# EAGLE board TCU_UCU_PCB_Rev2 (EAGLE 9.6.2)
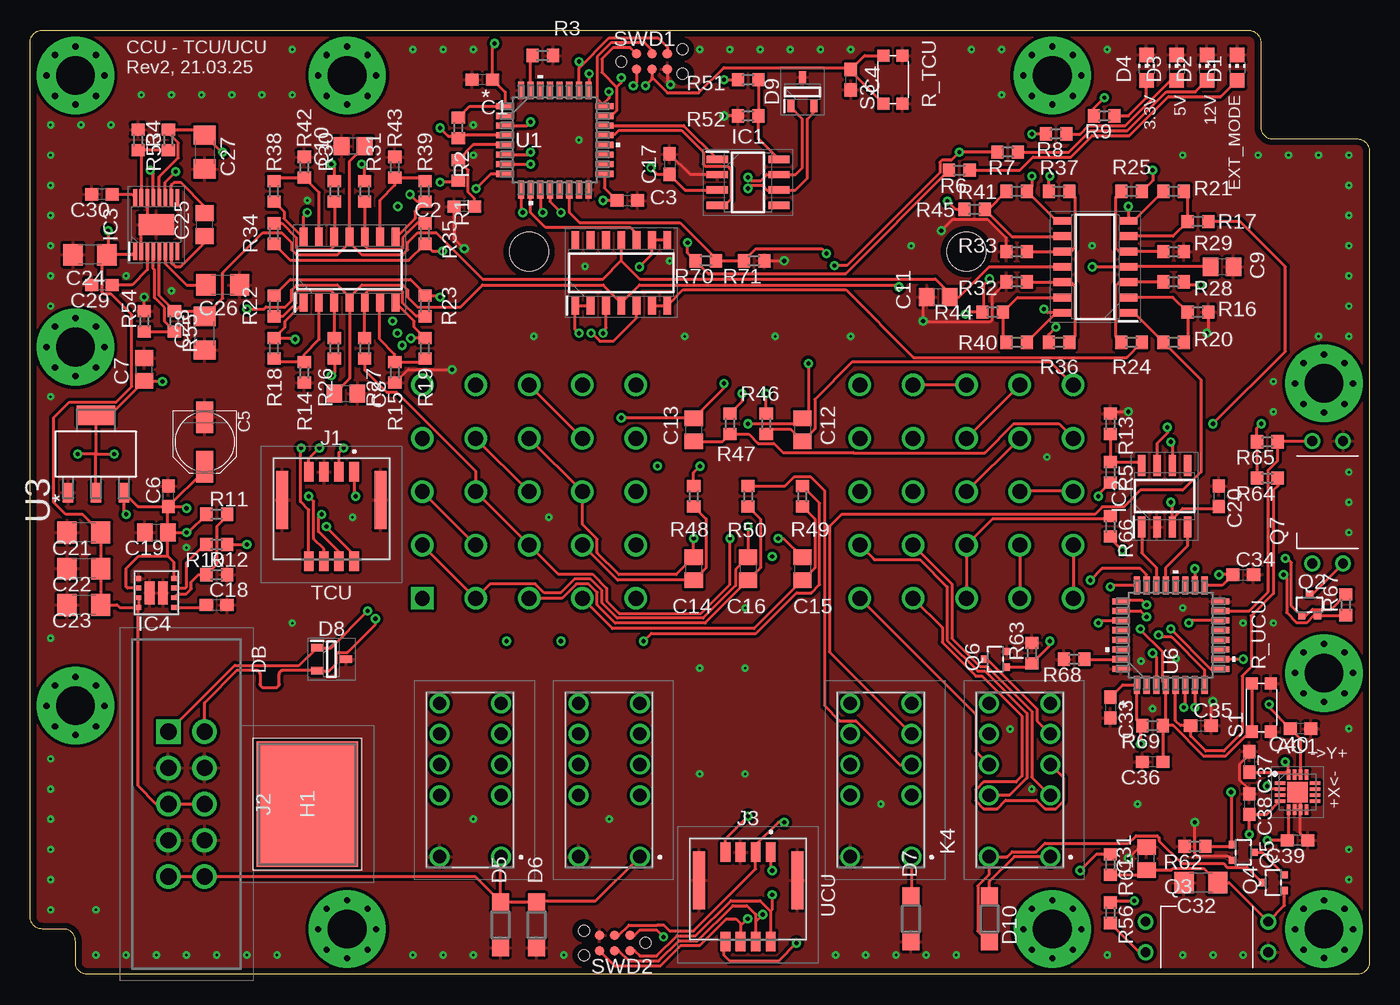
[diagram p7: board, top side]
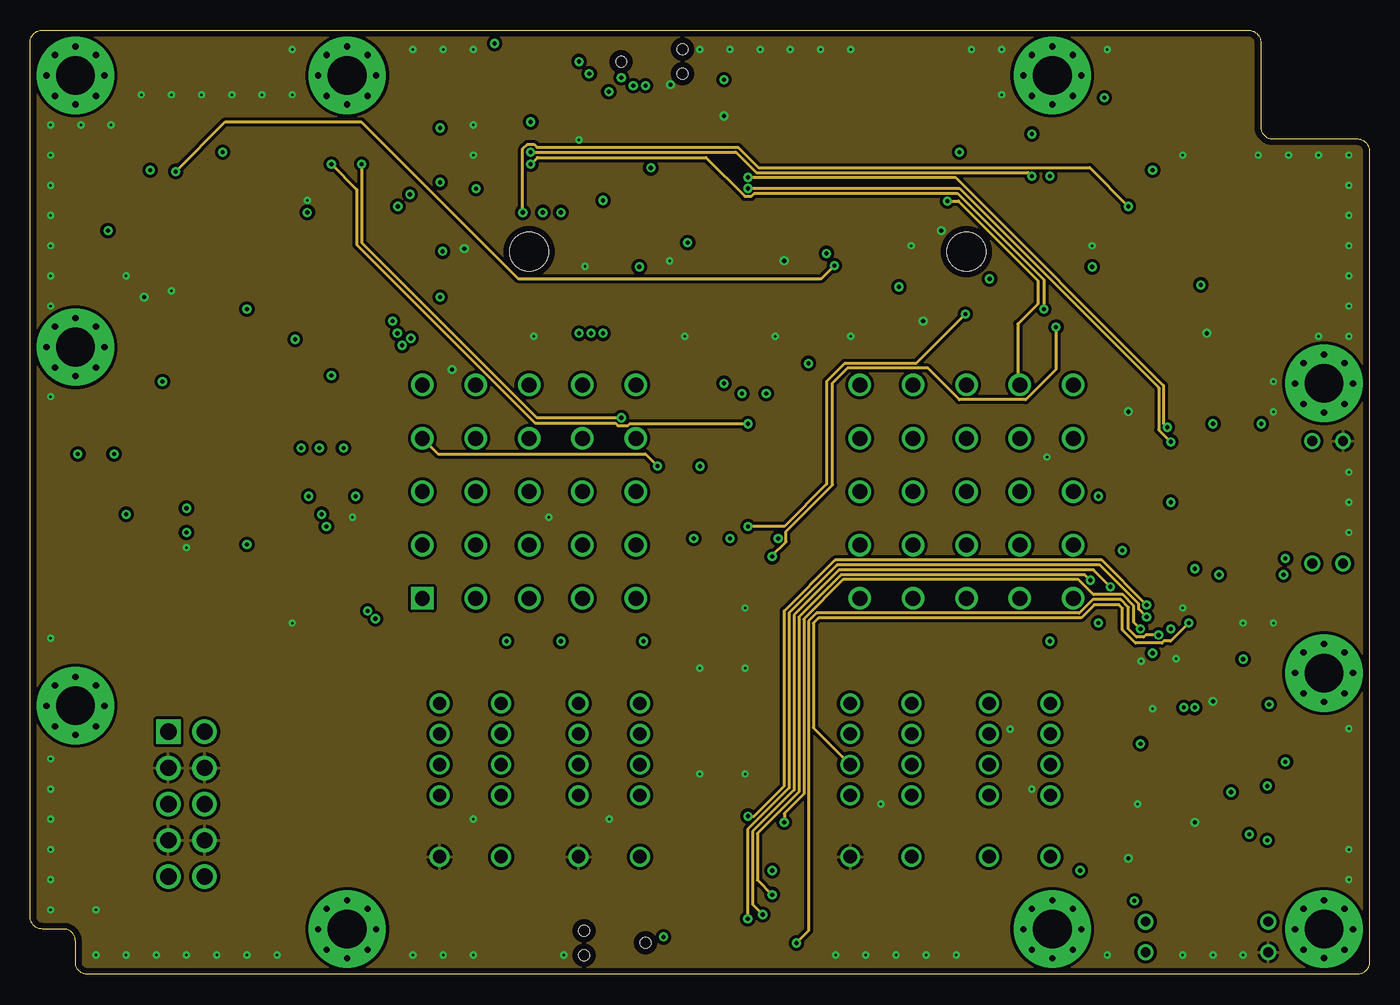
[diagram p8: board, inner layer Route2]
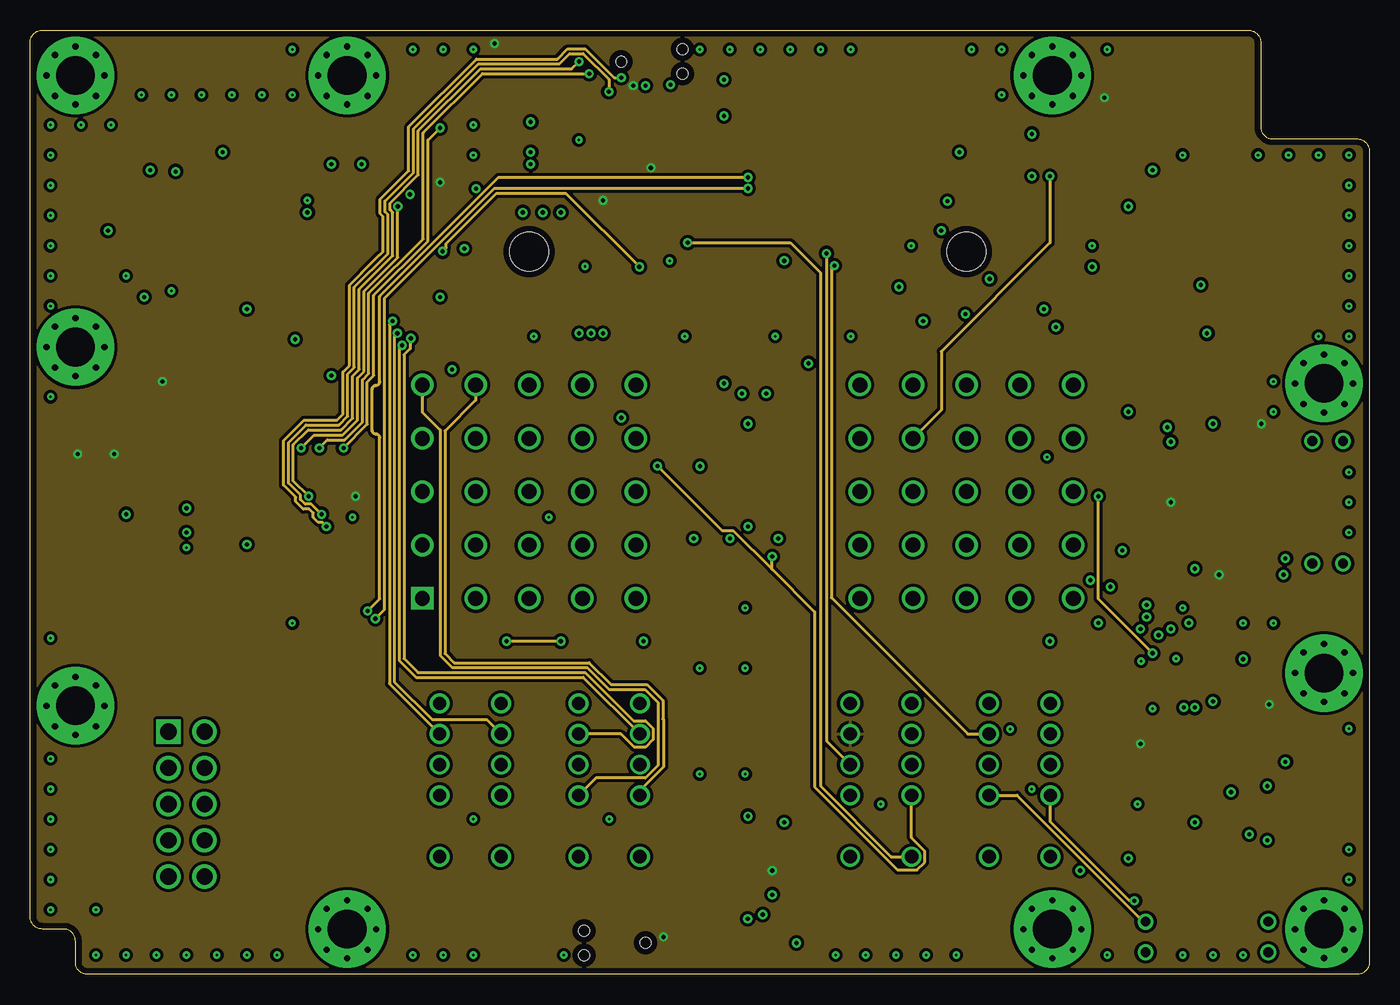
[diagram p9: board, inner layer Route15]
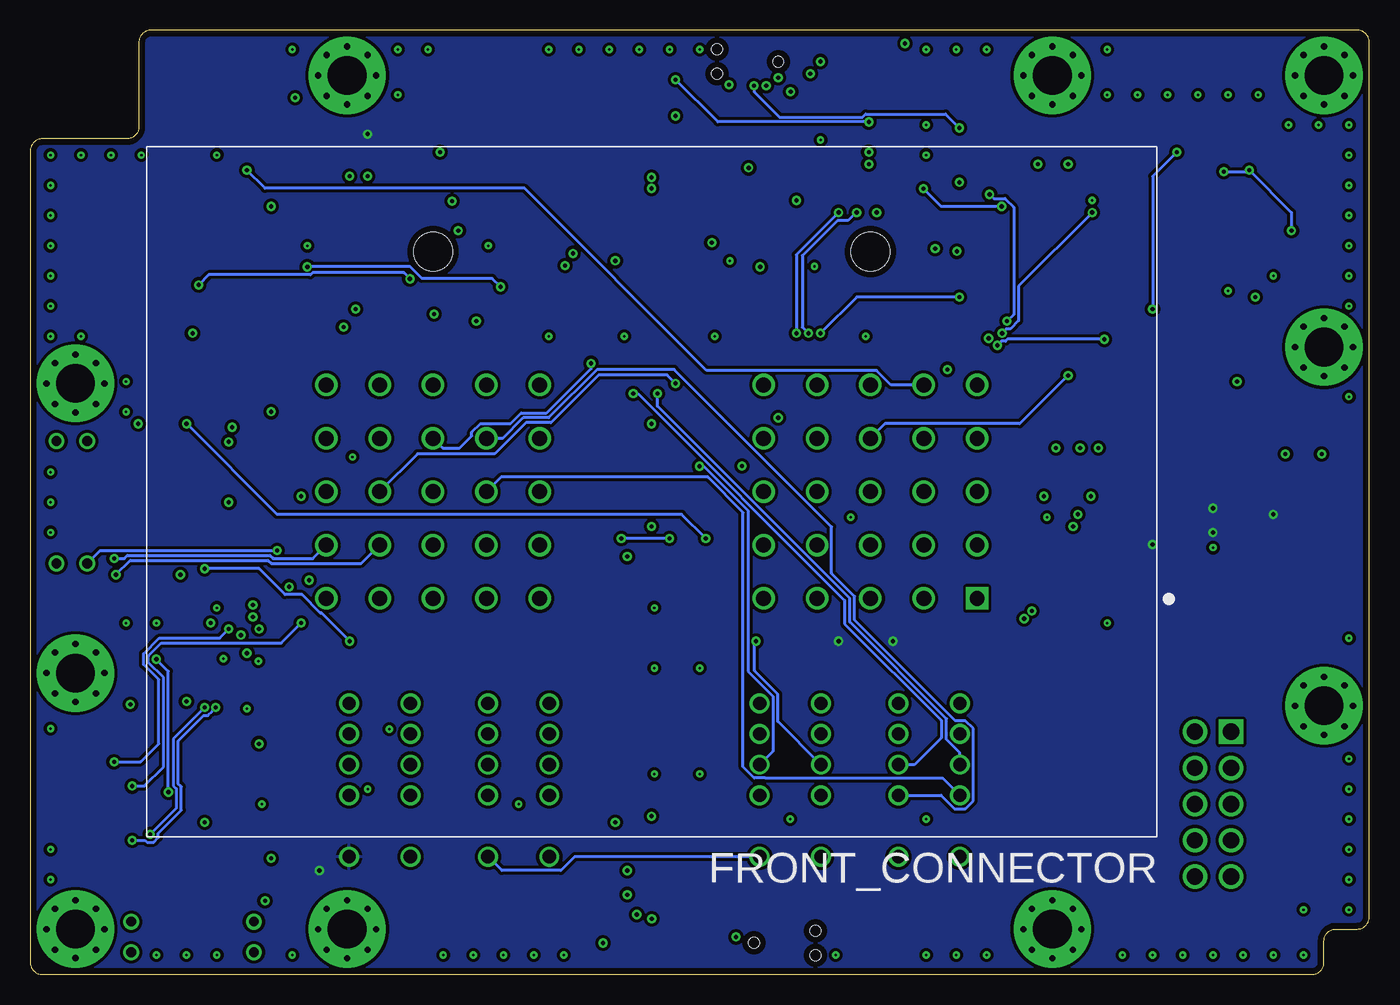
[diagram p10: board, bottom side, seen from below]

Size 110.89 x 78.2 mm. Coordinates in mm from the lower left corner, seen from the top.
Outline: 1,78.2 100.89,78.2 arc-90 101.89,77.2 101.89,70.2 arc90 102.89,69.2 109.89,69.2 arc-90 110.89,68.2 110.89,1 arc-90 109.89,0 4.75,0 arc-90 3.75,1 3.75,2.75 arc90 2.75,3.75 1,3.75 arc-90 0,4.75 0,77.2 arc-90 1,78.2
Copper layers (1+2*15+16): Top 0.043mm / dielectric 0.1248mm / Route2 0.035mm / dielectric 1.2mm / Route15 0.035mm / dielectric 0.1248mm / Bottom 0.043mm
Design rules "default *": minimum track width 6mil, minimum drill 0.2mm, track to track 6mil, track to pad 6mil, pad to pad 6mil, via to via 6mil, smd to smd 6mil, copper to edge 20mil, drill to drill 6mil, minimum pad ring 10mil, minimum via ring 8mil, stop-mask expansion 4mil, vias tented up to drill 0mil, thermal gap 10mil
Net classes: 0 default: width 0.2 mm; 1 12VPower: width 3.81 mm

## Footprints (pad centres in the part's own frame; a part is rotated, then mirrored left to right if it is on the bottom)
QFN50P300X300X150-17N = smd 0.85 x 0.3: 1 -1.45,0.75; 2 -1.45,0.25; 3 -1.45,-0.25; 4 -1.45,-0.75; 9 1.45,-0.75; 10 1.45,-0.25; 11 1.45,0.25; 12 1.45,0.75 | smd 0.3 x 0.85: 5 -0.75,-1.45; 6 -0.25,-1.45; 7 0.25,-1.45; 8 0.75,-1.45; 13 0.75,1.45; 14 0.25,1.45; 15 -0.25,1.45; 16 -0.75,1.45 | smd 1.7 x 1.7: 17 0,0
C0603 = smd 1.1 x 1: 1 -0.85,0; 2 0.85,0
PANASONIC_C = smd 2.6 x 1.4: + 2.05,0; - -2.05,0
C0805 = smd 1.3 x 1.5: 1 -0.95,0; 2 0.95,0
C1206 = smd 1.6 x 1.8: 1 -1.4,0; 2 1.4,0
CHIP-LED0805 = smd 1.2 x 1.2: A 0,-1.05; C 0,1.05
SOD123 = smd 1.4 x 1.4: A 1.9,0; C -1.9,0
SOT96P237X111-3N = smd 1 x 0.6: 1 -1.2,0.955; 2 -1.2,-0.955; 3 1.2,0
TE_DRC22-50P01 = drill 1.24 square: 1 -26.95,8.84 | drill 1.24: 2 -22.53,8.84; 3 -18.11,8.84; 4 -13.69,8.84; 5 -9.27,8.84; 6 9.27,8.84; 7 13.69,8.84; 8 18.11,8.84; 9 22.53,8.84; 10 26.95,8.84; 11 -26.95,4.42; 12 -22.53,4.42; 13 -18.11,4.42; 14 -13.69,4.42; 15 -9.27,4.42; 16 9.27,4.42; 17 13.69,4.42; 18 18.11,4.42; 19 22.53,4.42; 20 26.95,4.42; 21 -26.95,0; 22 -22.53,0; 23 -18.11,0; 24 -13.69,0; 25 -9.27,0; 26 9.27,0; 27 13.69,0; 28 18.11,0; 29 22.53,0; 30 26.95,0; 31 -26.95,-4.42; 32 -22.53,-4.42; 33 -18.11,-4.42; 34 -13.69,-4.42; 35 -9.27,-4.42; 36 9.27,-4.42; 37 13.69,-4.42; 38 18.11,-4.42; 39 22.53,-4.42; 40 26.95,-4.42; 41 -26.95,-8.84; 42 -22.53,-8.84; 43 -18.11,-8.84; 44 -13.69,-8.84; 45 -9.27,-8.84; 46 9.27,-8.84; 47 13.69,-8.84; 48 18.11,-8.84; 49 22.53,-8.84; 50 26.95,-8.84 | hole 3.2: 18.11,-19.89; -18.11,-19.89
S813146R = smd 10.4 x 8.4: 1 0,0
SOT127P600X175-8N = smd 1.75 x 0.6: 1 -2.55,1.905; 2 -2.55,0.635; 3 -2.55,-0.635; 4 -2.55,-1.905; 5 2.55,-1.905; 6 2.55,-0.635; 7 2.55,0.635; 8 2.55,1.905
SOP50P490X110-17N = smd 1.425 x 0.3: 1 -2.212,1.75; 2 -2.212,1.25; 3 -2.212,0.75; 4 -2.212,0.25; 5 -2.212,-0.25; 6 -2.212,-0.75; 7 -2.212,-1.25; 8 -2.212,-1.75; 9 2.212,-1.75; 10 2.212,-1.25; 11 2.212,-0.75; 12 2.212,-0.25; 13 2.212,0.25; 14 2.212,0.75; 15 2.212,1.25; 16 2.212,1.75 | smd 1.753 x 2.947: 17 0,0
SIL0008E = smd 0.45 x 0.4: 1 -1.475,1.2; 2 -1.475,0.4; 3 -1.475,-0.4; 4 -1.475,-1.2; 5 1.475,-1.2; 6 1.475,-0.4; 7 1.475,0.4; 8 1.475,1.2 | smd 0.8 x 1.9: 9 0.55,0; 10 -0.55,0
5054330871 = smd 0.8 x 1.6: 1 1.875,3.517; 2 1.875,-3.873; 3 0.625,3.517; 4 0.625,-3.873; 5 -0.625,3.517; 6 -0.625,-3.873; 7 -1.875,3.517; 8 -1.875,-3.873 | smd 1 x 4.8: MP1 4.075,1.177; MP2 -4.075,1.177
M300MV31045M1 = drill 1.35 pad 2.025 square: 1 0,0 | drill 1.35 pad 2.025: 2 3,0; 3 6,0; 4 9,0; 5 12,0; 6 0,3; 7 3,3; 8 6,3; 9 9,3; 10 12,3
413937885 = drill 1.1 pad 1.65: 1 -6.35,-2.54; 3 -1.27,-2.54; 4 1.27,-2.54; 5 3.81,-2.54; 6 6.35,-2.54; 7 6.35,2.54; 8 3.81,2.54; 9 1.27,2.54; 10 -1.27,2.54; 12 -6.35,2.54
SOT323 = smd 0.6 x 0.55: 1 -0.65,-0.925; 2 0.65,-0.925; 3 0,0.925
DIL04-400 = drill 0.813 pad 1.3: 1 -1.27,-5.08; 2 1.27,-5.08; 3 1.27,5.08; 4 -1.27,5.08
R0603 = smd 1 x 1.1: 1 -0.85,0; 2 0.85,0
KMR621NGLFS = smd 1 x 1: 1 -2,-0.8; 2 2,-0.8; 3 -2,0.8; 4 2,0.8
TC2030-IDC-NL = smd 0.787 x 0.787: 1 1.27,-0.635; 2 1.27,0.635; 3 2.54,-0.635; 4 2.54,0.635; 5 3.81,-0.635; 6 3.81,0.635 | hole 0.889: 0,0; 5.08,-1.016; 5.08,1.016
LQFP-32 = smd 1.473 x 0.508: 1 -4.115,2.8; 2 -4.115,2; 3 -4.115,1.2; 4 -4.115,0.4; 5 -4.115,-0.4; 6 -4.115,-1.2; 7 -4.115,-2; 8 -4.115,-2.8; 17 4.115,-2.8; 18 4.115,-2; 19 4.115,-1.2; 20 4.115,-0.4; 21 4.115,0.4; 22 4.115,1.2; 23 4.115,2; 24 4.115,2.8 | smd 0.508 x 1.473: 9 -2.8,-4.115; 10 -2,-4.115; 11 -1.2,-4.115; 12 -0.4,-4.115; 13 0.4,-4.115; 14 1.2,-4.115; 15 2,-4.115; 16 2.8,-4.115; 25 2.8,4.115; 26 2,4.115; 27 1.2,4.115; 28 0.4,4.115; 29 -0.4,4.115; 30 -1.2,4.115; 31 -2,4.115; 32 -2.8,4.115
SOIC127P600X175-14N = smd 1.525 x 0.65: 1 -2.712,3.81; 2 -2.712,2.54; 3 -2.712,1.27; 4 -2.712,0; 5 -2.712,-1.27; 6 -2.712,-2.54; 7 -2.712,-3.81; 8 2.712,-3.81; 9 2.712,-2.54; 10 2.712,-1.27; 11 2.712,0; 12 2.712,1.27; 13 2.712,2.54; 14 2.712,3.81
SOT230P700X180-4N = smd 1.626 x 0.889: 1 -3.2,2.311; 2 -3.2,0; 3 -3.2,-2.311 | smd 1.626 x 3.175: 4 3.2,0
M3_MOUNTING_HOLE = drill 0.5 pad 0.8: P$1 -2.4,0; P$2 0,2.4; P$3 2.4,0; P$4 0,-2.4; P$5 -1.697,1.697; P$6 1.697,1.697; P$7 1.697,-1.697; P$8 -1.697,-1.697 | drill 3.2 pad 6.4: P$10 0,0

## Placement (x,y rotation side)
AC1  ADXL377BCPZ-RL7  [QFN50P300X300X150-17N]  104.95,15.1 0 top
C1  0.1uF  [C0603]  37.45,74.1 180 top
C2  0.1uF  [C0603]  35.95,63.6 180 top
C3  0.1uF  [C0603]  49.45,64.1 0 top
C4  0.1uF  [C0603]  67.95,74.1 270 top
C5  100uF  [PANASONIC_C]  14.45,44.1 270 top
C6  100nF  [C0603]  11.45,39.6 90 top
C7  10uF  [C0805]  9.45,50.1 90 top
C8  0.1uF  [C0805]  26.15,48.1 0 top
C9  0.1uF  [C0805]  98.7,58.6 0 top
C10  0.1uF  [C0805]  26.75,68.6 180 top
C11  0.1uF  [C0805]  75.2,56.1 180 top
C12  10 uF  [C0805]  63.95,45.1 270 top
C13  10 uF  [C0805]  54.95,45.1 270 top
C14  10 uF  [C0805]  54.95,33.6 270 top
C15  10 uF  [C0805]  63.95,33.6 270 top
C16  10 uF  [C0805]  59.45,33.6 270 top
C17  0.1uF  [C0603]  52.95,67.1 270 top
C18  3.3nF  [C0603]  15.45,30.6 0 top
C19  22uF  [C0805]  10.45,36.6 180 top
C20  0.1uF  [C0603]  98.45,39.6 270 top
C21  10uF  [C1206]  4.45,36.6 180 top
C22  10uF  [C1206]  4.45,33.6 180 top
C23  10uF  [C1206]  4.45,30.6 180 top
C24  10uF  [C1206]  4.95,59.6 180 top
C25  1uF  [C0805]  14.45,62.1 90 top
C26  10uF  [C1206]  15.95,57.1 180 top
C27  10uF  [C1206]  14.45,68.1 270 top
C28  10uF  [C1206]  14.45,53.1 90 top
C29  10nF  [C0603]  5.95,57.1 180 top
C30  10nF  [C0603]  5.95,64.6 180 top
C31  10 uF  [C0805]  92.45,9.6 90 top
C32  -  [C1206]  96.95,7.6 180 top
C33  0.1uF  [C0603]  89.45,22.1 270 top
C34  0.1uF  [C0603]  100.45,33.1 0 top
C35  0.1uF  [C0603]  96.95,20.6 0 top
C36  0.1uF  [C0603]  92.95,17.6 180 top
C37  50nF  [C0603]  100.95,17.6 270 top
C38  50nF  [C0603]  100.95,14.1 270 top
C39  50nF  [C0603]  104.95,11.1 180 top
C40  0.1uF  [C0603]  105.2,20.35 180 top
D1  12V_AUTO-POW  [CHIP-LED0805]  99.95,75.1 0 top
D2  12V-POW  [CHIP-LED0805]  97.45,75.1 0 top
D3  5V-POW  [CHIP-LED0805]  94.95,75.1 0 top
D4  3.3V-POW  [CHIP-LED0805]  92.45,75.1 0 top
D5  PMEG4010  [SOD123]  38.95,4.1 270 top
D6  PMEG4010  [SOD123]  41.95,4.1 270 top
D7  PMEG4010  [SOD123]  72.95,4.6 270 top
D8  SZNUP2105LT1G  [SOT96P237X111-3N]  24.95,26.1 0 top
D9  SZNUP2105LT1G  [SOT96P237X111-3N]  63.95,73.1 90 top
D10  PMEG4010  [SOD123]  79.45,4.6 270 top
FRONT_CONNECTOR  DRC22-50P01  [TE_DRC22-50P01]  59.42,39.97 180 bottom
H1  S8131-46R  [S813146R]  22.95,14.1 90 top
IC1  SN65HVD230DR  [SOT127P600X175-8N]  59.45,65.6 0 top
IC2  SN65HVD230DR  [SOT127P600X175-8N]  93.95,39.6 90 top
IC3  LTC3260EMSE#PBF  [SOP50P490X110-17N]  10.45,62.1 90 top
IC4  LMZ21700SILT  [SIL0008E]  10.45,31.6 180 top
J1  505433-0871  [5054330871]  24.95,38.1 0 top
J2  M300-MV31045M1  [M300MV31045M1]  11.45,20.1 270 top
J3  505433-0871  [5054330871]  59.45,6.6 0 top
K1  V23079A1003B301  [413937885]  36.45,16.1 90 top
K2  V23079A1003B301  [413937885]  47.95,16.1 90 top
K3  V23079A1003B301  [413937885]  70.45,16.1 90 top
K4  V23079A1001B301  [413937885]  81.95,16.1 90 top
Q2  2N7002PW,115  [SOT323]  105.95,30.6 0 top
Q3  VO618A-3  [DIL04-400]  97.45,3.1 270 top
Q4  2N7002PW,115  [SOT323]  102.95,7.6 90 top
Q5  2N7002PW,115  [SOT323]  100.45,10.1 270 top
Q6  2N7002PW,115  [SOT323]  79.95,26.1 90 top
Q7  VO618A-3  [DIL04-400]  107.45,39.1 0 top
R1  BLM18PG471SN1D  [R0603]  35.45,66.6 270 top
R2  10K  [R0603]  35.45,70.1 90 top
R3  10K  [R0603]  42.45,76.1 0 top
R4  1.3M  [R0603]  11.45,69.1 90 top
R5  -  [R0603]  89.45,41.6 270 top
R6  4K3  [R0603]  76.95,66.6 180 top
R7  4K3  [R0603]  80.95,68.1 180 top
R8  1K6  [R0603]  84.95,69.6 180 top
R9  1K1  [R0603]  88.95,71.1 180 top
R10  10K 1%  [R0603]  15.45,35.6 180 top
R11  232K 1%  [R0603]  15.45,38.1 0 top
R12  44K2 1%  [R0603]  15.45,33.1 0 top
R13  0R  [R0603]  89.45,45.6 270 top
R14  4k7  [R0603]  22.7,49.85 270 top
R15  4k7  [R0603]  30.2,49.85 270 top
R16  4k7  [R0603]  96.7,54.85 0 top
R17  6k8  [R0603]  96.7,62.35 0 top
R18  6k8  [R0603]  20.2,51.85 270 top
R19  6k8  [R0603]  32.7,51.85 270 top
R20  6k8  [R0603]  94.7,52.35 0 top
R21  3k9  [R0603]  94.7,64.85 0 top
R22  4k7  [R0603]  20.2,55.35 90 top
R23  4k7  [R0603]  32.7,55.35 90 top
R24  4k7  [R0603]  91.2,52.35 0 top
R25  6k8  [R0603]  91.2,64.85 0 top
R26  6k8  [R0603]  25.2,51.85 90 top
R27  6k8  [R0603]  27.7,51.85 90 top
R28  6k8  [R0603]  94.7,57.35 180 top
R29  3k9  [R0603]  94.7,59.85 180 top
R30  6k8  [R0603]  25.2,64.85 270 top
R31  6k8  [R0603]  27.7,64.85 270 top
R32  3k9  [R0603]  81.7,57.35 0 top
R33  3k9  [R0603]  81.7,59.85 0 top
R34  4k7  [R0603]  20.2,61.35 270 top
R35  4k7  [R0603]  32.7,61.35 270 top
R36  6k8  [R0603]  85.2,52.35 180 top
R37  6k8  [R0603]  85.2,64.85 180 top
R38  6k8  [R0603]  20.2,64.85 90 top
R39  6k8  [R0603]  32.7,64.85 90 top
R40  3k9  [R0603]  81.7,52.35 180 top
R41  3k9  [R0603]  81.7,64.85 180 top
R42  4k7  [R0603]  22.7,66.85 90 top
R43  4k7  [R0603]  30.2,66.85 90 top
R44  6k8  [R0603]  79.7,54.85 180 top
R45  6k8  [R0603]  78.2,63.35 180 top
R46  200R  [R0603]  60.95,45.6 90 top
R47  200R  [R0603]  57.95,45.6 270 top
R48  200R  [R0603]  54.95,39.6 90 top
R49  200R  [R0603]  63.95,39.6 90 top
R50  200R  [R0603]  59.45,39.6 90 top
R51  -  [R0603]  59.45,74.1 180 top
R52  0R  [R0603]  59.45,71.1 0 top
R53  200K  [R0603]  8.95,69.1 270 top
R54  200K  [R0603]  9.45,54.1 90 top
R55  1.3M  [R0603]  11.95,54.1 270 top
R56  10K  [R0603]  89.45,5.1 270 top
R61  100K  [R0603]  89.45,9.1 270 top
R62  10K  [R0603]  96.45,10.6 180 top
R63  10K  [R0603]  82.95,26.6 90 top
R64  BLM18PG471SN1D  [R0603]  102.45,41.1 180 top
R65  10K  [R0603]  102.45,44.1 180 top
R66  113K  [R0603]  89.45,37.1 270 top
R67  100K  [R0603]  108.95,30.6 90 top
R68  10K  [R0603]  86.45,26.1 180 top
R69  10K  [R0603]  92.95,20.6 180 top
R70  15K  [R0603]  55.95,59.1 180 top
R71  3K9  [R0603]  59.95,59.1 180 top
S1  KMR621NGLFS  [KMR621NGLFS]  101.95,22.1 90 top
S3  KMR621NGLFS  [KMR621NGLFS]  71.45,74.1 90 top
SWD1  SWD_TAGCONNECTNO-LEG  [TC2030-IDC-NL]  48.95,75.6 0 top
SWD2  SWD_TAGCONNECTNO-LEG  [TC2030-IDC-NL]  50.95,2.6 180 top
U1  STM32F303K8  [LQFP-32]  43.45,69.1 0 top
U2  TL074ID  [SOIC127P600X175-14N]  48.95,58.1 90 top
U3  LD1117S33TR  [SOT230P700X180-4N]  5.45,43.1 90 top
U4  TL074ID  [SOIC127P600X175-14N]  26.45,58.35 90 top
U5  TL074ID  [SOIC127P600X175-14N]  88.2,58.6 180 top
U6  STM32F303K8  [LQFP-32]  94.45,28.1 90 top
U$1  M3_MOUNTING_HOLE  [M3_MOUNTING_HOLE]  26.25,3.75 90 top
U$2  M3_MOUNTING_HOLE  [M3_MOUNTING_HOLE]  84.64,3.75 90 top
U$3  M3_MOUNTING_HOLE  [M3_MOUNTING_HOLE]  107.14,3.75 90 top
U$4  M3_MOUNTING_HOLE  [M3_MOUNTING_HOLE]  107.14,24.95 90 top
U$5  M3_MOUNTING_HOLE  [M3_MOUNTING_HOLE]  107.14,48.95 90 top
U$6  M3_MOUNTING_HOLE  [M3_MOUNTING_HOLE]  84.64,74.45 90 top
U$7  M3_MOUNTING_HOLE  [M3_MOUNTING_HOLE]  26.25,74.45 90 top
U$8  M3_MOUNTING_HOLE  [M3_MOUNTING_HOLE]  3.75,74.45 90 top
U$9  M3_MOUNTING_HOLE  [M3_MOUNTING_HOLE]  3.75,51.95 90 top
U$10  M3_MOUNTING_HOLE  [M3_MOUNTING_HOLE]  3.75,22.25 90 top

## Tracks (layer width: path | path; a pad name or v marks a point on that pad's centre or on a via)
12V  (via drill 0.35)
  Top 0.25: C24.1 8.41,59.6 IC3.1 | IC4.8 7.4,30.4 7.2,30.6 C23.1 C22.1 C21.1 4.35,38.1 2.95,38.1 1.95,39.1 1.95,46.1 3.24,47.39 7.12,47.39 8.42,48.69 8.42,54.63 6.72,56.32 6.13,56.32 5.97,56.48 5.97,57.08 5.95,57.1 5.95,59.2 C24.1 | IC4.7 IC4.8 | IC4.8 8.95,30.37 8.95,15.6 10.45,14.1 J2.3 J2.8 | IC3.13 10.2,66.35 v9.95,66.6 | v6.45,61.6 6.45,59.7 C24.1 | IC3.11 11.2,65.63 v12.06,66.49 | R7.2 v76.95,68.1 76.27,67.43 75.48,67.43 75.32,67.26 75.32,66.39 67.63,58.7 v66.6,58.7
  Route2 0.25: v12.06,66.49 16.17,70.6 27.42,70.6 40.39,57.63 65.53,57.63 v66.6,58.7
  Route15 0.25: v66.6,58.7 66.35,58.45 66.35,31.2 77.64,19.91 K4.8
  Bottom 0.25: v6.45,61.6 6.45,63.1 v9.95,66.6 10.06,66.49 v12.06,66.49
+3V3  (via drill 0.35)
  Top 0.25: U3.2 5.45,43.1 | 5.45,43.1 U3.4 6.6,46.3 C7.1 10.9,49.15 v10.95,49.1 | 5.45,43.1 v3.95,43.1 | 5.45,43.1 v6.95,43.1 | J1.1 26.82,39.72 v26.95,39.6 | v38.45,77.1 38.3,76.95 C1.1 39.33,73.06 U1.1 36.4,71.9 R2.2 | R1.2 35.3,65.6 v33.95,65.6 | U1.17 47.56,65.13 C3.1 v47.45,64.1 | IC1.3 54.23,64.96 C17.2 51.95,66.25 v51.4,66.8 | R9.2 88.1,71.75 v88.95,72.6 | U6.17 98.71,32.21 C34.1 v98.45,33.1 | C20.2 98.45,38.6 95.45,38.6 94.58,37.73 IC2.3 94.58,38.96 v94.45,39.1 | R64.2 R65.2 101.6,45.25 v101.95,45.6 | v91.95,19.1 91.95,20.45 R69.2 91.65,21.05 U6.1 90.48,23.98 C33.1 | J3.1 61.32,8.72 v61.45,8.6 | SWD1.1 50.22,73.87 v49.95,73.6 | SWD2.1 50.06,3.23 50.5,3.68 51.87,3.68 v52.45,3.1 | AC1.15 AC1.14 105.2,19.5 C40.2 102.6,22.1 v102.6,22.35
  pour Route15 (isolate 0.254): -0.05,78.6 110.95,78.6 110.95,0.1 -0.05,0.1
+5V  (via drill 0.35)
  Top 0.25: K4.1 81.49,9.75 79.45,7.71 D10.C | IC4.4 11.92,34.12 11.4,34.65 | 11.4,34.65 C19.1 | C19.1 11.4,38.7 C6.1 | IC4.6 8.05,32 7.95,32.1 7.95,33.6 9,34.65 11.4,34.65 | C19.1 v12.95,36.6 13.1,36.6 R11.1 | R10.1 v17.95,35.6 | C6.1 8.91,38.75 U3.3 7.76,38.29 v7.95,38.1 | C6.1 14.45,41.75 C5.+ | C6.1 12.8,38.75 v12.95,38.6 | R8.2 v82.95,69.6 | R61.1 88.3,9.95 v86.95,8.6
  Route15 0.25: v39.45,27.6 v43.95,27.6
  pour Bottom (isolate 0.254): -0.05,80.1 -0.05,0.1 110.95,0.1 110.95,79.6 110.95,80.1
+9V  (via drill 0.35)
  Top 0.25: IC3.12 10.7,66.06 12.27,67.63 12.27,68.86 11.45,69.69 R4.2 14,69.95 C27.1 15.85,68.1 v15.95,68.1 | C8.1 26.45,49.35 U4.4 26.45,56.1 | v17.95,55.1 19.35,55.1 19.53,55.28 21.12,55.28 21.63,55.78 21.63,56.68 22.05,57.1 25.45,57.1 26.45,56.1 | 26.45,56.1 27.45,57.1 30.84,57.1 31.26,56.68 31.26,56.1 32.08,55.28 35.62,55.28 37.45,57.1 47.45,57.1 48.95,55.6 | C9.1 U5.4 v87.95,58.6 | U2.4 48.95,55.6 | 48.95,55.6 50.45,57.1 71.79,57.1 v71.95,56.94
  Bottom 0.25: v15.95,68.1 17.95,66.1 v17.95,55.1 | v87.95,58.6 79.43,58.6 78.46,57.63 72.64,57.63 v71.95,56.94
+12V  (via drill 0.35)
  Top 0.25: D5.C 36.85,8.1 J2.10 J2.5 | D5.C D6.C 42.05,6.1 46.84,6.1 K2.1 | D5.C 38.95,9.71 K1.1 | K3.1 72.99,6.54 D7.C | R6.2 67.55,58.05 56.15,58.05 R70.2 54.45,59.75 v54.45,60.6
  Route15 0.25: v54.45,60.6 62.95,60.6 65.45,58.1 65.45,15.6 71.3,9.75 K3.1
  Bottom 0.25: K2.1 65.8,9.75 66.95,8.6 71.84,8.6 K3.1
-9V
  Top 0.25: IC3.5 10.7,56.2 R55.1 14,54.95 C28.2 15.95,56 15.95,58.1 19.27,61.42 20.81,61.42 21.63,60.6 21.63,60.02 22.05,59.6 25.45,59.6 26.45,60.6 | C10.1 26.45,67.35 U4.11 26.45,60.6 | 26.45,60.6 27.45,59.6 30.84,59.6 31.26,60.02 31.26,60.6 32.08,61.42 33.62,61.42 37.45,57.6 47.45,57.6 48.95,59.1 | C11.1 76.45,56.1 | 76.45,56.1 76.93,56.1 79.43,58.6 U5.11 | U2.11 48.95,59.1 | 48.95,59.1 50.45,57.6 74.95,57.6 76.45,56.1
ACC_ST  (via drill 0.35)
  Top 0.25: AC1.2 102.7,15.35 v102.45,15.6 | v88.45,29.1 88.65,29.3 U6.27
  Bottom 0.25: v102.45,15.6 101.45,15.6 99.85,17.2 99.85,24.57 101.1,25.83 101.1,26.37 100.03,27.44 90.1,27.44 v88.45,29.1
ACC_X  (via drill 0.35)
  Top 0.25: AC1.5 104.2,11.2 C39.2 v102.45,11.1 | v95.54,22.1 95.65,22.21 U6.6
  Bottom 0.25: v102.45,11.1 101.37,11.1 101.22,10.94 100.67,10.94 100.29,11.33 100.29,11.69 98.39,13.59 98.39,15.54 98.45,15.59 98.45,15.6 98.64,15.79 98.64,19.33 96.53,21.44 96.17,21.44 95.79,21.83 95.79,21.85 v95.54,22.1
ACC_Y  (via drill 0.35)
  Top 0.25: AC1.4 102.4,13.25 C38.2 v100.95,11.6 | U6.7 v96.45,22.1
  Bottom 0.25: v96.45,22.1 99.04,19.5 99.04,15.62 98.79,15.37 98.79,13.75 v100.95,11.6
ACC_Z  (via drill 0.35)
  Top 0.25: C37.2 104,16.75 AC1.16 104.2,17.35 v103.95,17.6 | v94.45,28.6 97.75,25.3 U6.9
  Bottom 0.25: v103.95,17.6 101.75,17.6 100.25,19.1 100.25,24.41 101.5,25.66 101.5,26.54 100.2,27.85 95.2,27.85 v94.45,28.6
APS1_GND  (via drill 0.35)
  Top 0.25: FRONT_CONNECTOR.33 FRONT_CONNECTOR.24 45.73,37.26 46.94,36.05 46.94,34.92 48.76,33.1 53.5,33.1 C14.1 v54.95,36.1 | R26.1 25.2,49.85 v24.95,49.6 | v97.95,45.6 103.95,51.6 103.95,58.6 100.2,62.35 R17.2
  Bottom 0.25: v24.95,49.6 28.94,45.6 40.11,45.6 FRONT_CONNECTOR.33 | v54.95,36.1 56.95,38.1 90.45,38.1 v97.95,45.6
APS1_IN  (via drill 0.35)
  Top 0.25: v92.95,66.6 92.95,65.75 R25.2
  Route15 0.25: FRONT_CONNECTOR.42 36.89,47.55 34.35,45 34.35,26.57 35.11,25.81 46.3,25.81 48.1,24 51.06,24 52.39,22.67 52.39,21.15 52.45,21.1 52.45,17.2 50.49,15.24 K2.3
  Bottom 0.25: FRONT_CONNECTOR.42 39.61,48.81 40.81,50.02 54.87,50.02 69.95,65.1 91.45,65.1 v92.95,66.6
APS1_OUT
  Top 0.25: FRONT_CONNECTOR.14 48.64,32.65 C14.2 55.97,33.68 55.97,37.72 R48.1
APS1_SIG_OUT  (via drill 0.35)
  Top 0.25: U4.1 22.44,55.44 22.44,55.43 21.1,54.1 21.1,53.6 R18.1 21.85,52.7 v21.95,52.6
  Route15 0.25: v30.81,52.1 30.56,51.85 30.56,25.99 31.95,24.6 45.8,24.6 K2.5
  Bottom 0.25: v21.95,52.6 29.98,52.6 30.14,52.44 30.46,52.44 v30.81,52.1
APS1_VCC
  Top 0.25: FRONT_CONNECTOR.34 FRONT_CONNECTOR.43
APS2_GND  (via drill 0.35)
  Top 0.25: v57.95,36.1 57.95,32.29 55.56,29.9 48.78,29.9 47.75,30.94 47.75,31.97 46.57,33.15 43.72,33.15 FRONT_CONNECTOR.13 FRONT_CONNECTOR.22 36.89,41.68 30.36,48.22 29.53,48.22 27.7,50.06 R27.1 | v61.95,36.1 62.4,36.1 C15.1
  Bottom 0.25: v57.95,36.1 v61.95,36.1
APS2_IN
  Route15 0.25: FRONT_CONNECTOR.41 32.47,46.57 33.95,45.1 33.95,26.4 34.95,25.4 46.13,25.4 47.93,23.6 50.9,23.6 51.99,22.5 51.99,17.31 50.94,16.27 46.84,16.27 K2.10
APS2_OUT
  Top 0.25: FRONT_CONNECTOR.4 48.22,28.65 59.95,28.65 C15.2 64.97,33.68 64.97,37.72 R49.1
APS2_SIG_OUT  (via drill 0.35)
  Top 0.25: U4.7 30.46,55.44 30.46,55.43 31.79,54.1 31.79,53.6 R19.1 31.55,52.7 v31.52,52.67
  Route15 0.25: v31.52,52.67 31.46,52.62 31.46,51.83 30.96,51.32 30.96,26.16 32.11,25 45.96,25 49.95,21.01 50.94,21.01 51.59,20.37 51.59,19.45 50.94,18.81 50.03,18.81 48.93,19.91 K2.8
APS2_VCC
  Top 0.25: FRONT_CONNECTOR.23 FRONT_CONNECTOR.32
APS_STM_ANOUT  (via drill 0.35)
  Top 0.25: R22.2 21.55,57.55 31.5,57.55 32.7,56.35 R23.2 33.85,56.2 v33.95,56.1 | v45.45,53.1 45.14,53.41 U2.1 U2.2
  Bottom 0.25: v33.95,56.1 42.45,56.1 v45.45,53.1
APS_STM_IN  (via drill 0.35)
  Top 0.25: U5.7 90.95,62.41 | 90.95,62.41 91.41,62.41 R21.1 | U1.9 40.65,63.24 v40.79,63.1 | v90.95,63.6 90.95,62.41
  Route2 0.25: v40.79,63.1 40.79,68.37 41.17,68.75 41.72,68.75 41.97,68.5 58.61,68.5 60.3,66.81 87.73,66.81 v90.95,63.6
APSFC_GND  (via drill 0.35)
  Top 0.25: FRONT_CONNECTOR.11 FRONT_CONNECTOR.2 38.1,32.34 41.81,32.34 42.56,31.6 43.92,31.6 45.07,32.74 46.4,32.74 47.34,31.8 47.34,30.77 48.61,29.5 55.73,29.5 58.42,32.19 58.42,33.52 C16.1 v59.45,37.1 | v79.45,57.6 78.95,57.1 78.95,54.95 R44.2 77.62,54.85 v77.45,54.68 | v96.95,57.1 95.8,57.1 R28.1
  Route2 0.25: v77.45,54.68 73.37,50.6 67.45,50.6 65.95,49.1 65.95,40.6 62.45,37.1 v59.45,37.1
  Bottom 0.25: v79.45,57.6 79.95,58.1 87.52,58.1 87.67,57.94 96.1,57.94 v96.95,57.1
APSFC_IN  (via drill 0.35)
  Top 0.25: R36.2 84.35,53 v84.95,53.6
  Route2 0.25: FRONT_CONNECTOR.31 33.77,43.1 50.95,43.1 v51.95,42.1 | v61.45,34.6 61.45,34.67 62.6,35.83 62.6,36.69 66.45,40.53 66.45,48.98 67.66,50.2 74.35,50.2 76.95,47.6 82.45,47.6 84.95,50.1 v84.95,53.6
  Route15 0.25: v51.95,42.1 57.29,36.75 58.22,36.75 61.41,33.56 | 61.41,33.56 64.95,30.03 64.95,15.53 71.83,8.65 73.44,8.65 74.09,9.29 74.09,10.21 72.99,11.31 K3.3 | 61.41,33.56 61.41,34.56 v61.45,34.6
APSFC_OUT
  Top 0.25: FRONT_CONNECTOR.3 44.03,31.13 45.23,32.34 46.23,32.34 46.94,31.63 46.94,30.6 48.45,29.1 55.9,29.1 C16.2 60.47,33.68 60.47,37.72 R50.1
APSFC_SIG_OUT
  Top 0.25: U5.1 91.41,54.79 R20.1 96.95,49.25 96.95,41.6 95.45,40.1 91.95,40.1 90.57,38.73 88.78,38.73 88.16,38.1 67.18,38.1 66.18,37.1 66.18,26.71 K3.5
APSFC_STM_ANOUT
  Top 0.25: U2.6 U2.7 54.07,56.7 67.55,56.7 73.15,51.1 90.8,51.1 R24.2
APSFC_STM_IN  (via drill 0.35)
  Top 0.25: R40.1 84.99,54.79 | 84.99,54.79 85.45,54.79 U5.14 | U1.7 v41.45,67.1 | 84.99,54.79 84.26,54.79 v83.95,55.1
  Route2 0.25: v41.45,67.1 42,67.65 55.97,67.65 59.17,64.44 59.72,64.44 59.97,64.7 76.78,64.7 83.95,57.53 v83.95,55.1
APSFC_VCC
  Top 0.25: FRONT_CONNECTOR.12 FRONT_CONNECTOR.21
BUZ_ECM_12V
  Top 0.25: FRONT_CONNECTOR.16 69.9,34.35 73.68,34.35 75.92,32.1 75.92,27.66 78.46,25.12 79.06,25.12 82.54,21.63 82.54,16.27 81.11,14.83 K4.10
  Route15 0.25: K4.10 81.72,14.83 92.18,4.37 Q3.1
BUZ_ECM_GND  (via drill 0.35)
  Top 0.25: R56.1 89.6,6.1 v91.45,6.1 | FRONT_CONNECTOR.17 76.33,32.34 76.33,27.83 78.63,25.52 79.22,25.52 82.95,21.8 82.95,16.32 84.44,14.83 K4.3
  Route15 0.25: v91.45,6.1 91.02,6.1 84.49,12.63 K4.3
BUZ_STE_12V
  Top 0.25: K4.9 78.3,18.47 78.3,21.52 FRONT_CONNECTOR.6
BUZ_STE_GND
  Top 0.25: FRONT_CONNECTOR.7 75.52,28.73 75.52,27.49 78.3,24.72 78.83,24.72 82.14,21.4 82.14,16.43 81.64,15.93 78.95,15.93 78.3,15.29 78.3,14.37 78.95,13.73 80.07,13.73 80.77,14.43 83.33,14.43 84.03,13.73 84.94,13.73 85.59,14.37 85.59,16.27 K4.4
BUZZER_EN  (via drill 0.35)
  Top 0.25: R62.1 99.37,10.6 Q5.1 99.52,15.02 v99.45,15.1 | v100.45,26.1 U6.10
  Bottom 0.25: v99.45,15.1 99.45,25.1 v100.45,26.1
BUZZER_ON  (via drill 0.35)
  Top 0.25: Q6.1 82.65,25.45 R63.1 84.45,27.25 v84.45,27.6 | v96.45,33.6 U6.18
  Bottom 0.25: v84.45,27.6 86.78,29.93 86.87,29.93 88.39,31.44 89.79,31.44 91.95,33.6 v96.45,33.6
CAN_N  (via drill 0.35)
  Top 0.25: J2.6 14.45,22.5 17.14,25.19 18.71,25.19 arc-90 19.02,24.87 19.02,24.07 arc90 19.34,23.75 20.31,23.75 arc90 20.63,24.07 20.63,24.87 arc-90 20.95,25.19 23.7,25.19 D8.2 24.75,25.14 25.37,25.77 25.37,26.51 25.53,26.68 26.28,26.68 28.59,28.99 v28.59,29.46 | v59.45,65.1 59.7,65.35 60.61,65.35 61,64.96 IC1.6 63.37,64.96 64.35,65.94 64.35,70.85 64.9,71.4 D9.2 | v94.45,44.1 94.58,43.96 IC2.6
  Route2 0.25: v59.45,65.1 76.95,65.1 93.45,48.6 93.45,45.1 v94.45,44.1
  Route15 0.25: v28.59,29.46 29.35,30.22 29.35,56 38.45,65.1 v59.45,65.1
CAN_P  (via drill 0.35)
  Top 0.25: v27.95,30.1 24.9,27.05 D8.1 22.29,25.6 16.95,25.6 J2.1 | v59.45,66.01 59.7,65.75 60.52,65.75 61,66.23 IC1.7 63.37,66.23 63.95,66.81 63.95,70.84 62.99,71.8 D9.1 | v94.16,45.31 94.16,44.81 93.31,43.96 IC2.7
  Route2 0.25: v59.45,66.01 76.61,66.01 93.85,48.77 93.85,45.6 94.14,45.31 v94.16,45.31
  Route15 0.25: v27.95,30.1 28.95,31.1 28.95,44.43 arc90 28.63,44.75 arc-90 28.32,45.06 28.32,48.47 arc-90 28.63,48.78 arc90 28.95,49.1 28.95,56.17 38.79,66.01 v59.45,66.01
D_TCU
  Top 0.25: U1.22 54.1,70.3 IC1.1
D_UCU
  Top 0.25: IC2.1 92.04,34.9 93.25,33.7 U6.22
GND  (via drill 0.2, 0.35)
  Top 0.25: IC3.14 9.7,62.85 10.2,62.35 | 10.2,62.35 IC3.17 | IC3.2 9.2,61.35 10.2,62.35 | C2.2 35.1,60.95 v35.95,60.1 | R52.1 v57.45,71.1 | SWD1.5 52.76,73.94 v53.02,73.68 | C11.2 73.95,55.8 v73.95,54.1 74.02,54.02 79.46,54.02 79.62,54.18 79.62,56.13 R32.1 | IC1.2 54.66,66.23 C17.1 | C31.2 91.9,10.55 v90.95,9.6 | R71.1 v62.45,59.1 | C39.1 105.2,11.7 AC1.7 | AC1.6 AC1.7 | AC1.17 105.2,14.85 AC1.7 | R16.2 97.55,53.2 v97.45,53.1 | R13.1 89.6,46.6 v90.95,46.6 | C35.2 97.8,22.45 v97.95,22.6 | Q5.2 99.2,9.77 96.68,9.77 96.45,10.01 v96.45,12.6 | R54.2 v9.45,56.1 | R33.1 80.85,60.98 79.3,62.52 76.37,62.52 v75.45,61.6 | R15.2 31.3,50.1 v34.95,50.1 | C38.1 100.95,15.31 100.17,16.08 100.17,17.41 100.95,18.19 C37.1
  other vias: 1.7,17.85 1.7,15.35 1.7,12.85 1.7,10.35 1.7,7.85 1.7,5.35 5.45,5.35 5.45,1.6 7.95,1.6 10.45,1.6 12.95,1.6 15.45,1.6 17.95,1.6 20.45,1.6 31.7,1.6 34.2,1.6 36.7,1.6 66.7,1.6 69.2,1.6 71.7,1.6 74.2,1.6 76.7,1.6 44.2,1.6 89.2,1.6 95.45,1.6 97.95,1.6 100.45,1.6 109.2,7.85 109.2,10.35 109.2,20.35 109.2,36.6 109.2,39.1 109.2,41.6 109.2,52.85 109.2,55.35 109.2,57.85 109.2,60.35 109.2,62.85 109.2,65.35 109.2,67.85 106.7,67.85 104.2,67.85 101.7,67.85 89.2,76.6 80.45,76.6 77.95,76.6 67.95,76.6 65.45,76.6 62.95,76.6 60.45,76.6 57.95,76.6 55.45,76.6 36.7,76.6 34.2,76.6 31.7,76.6 21.7,76.6 1.7,70.35 1.7,67.85 1.7,65.35 1.7,62.85 1.7,60.35 1.7,57.85 1.7,55.35 1.7,47.85 1.7,27.85 9.2,72.85 11.7,72.85 14.2,72.85 16.7,72.85 19.2,72.85 21.7,72.85 4.2,70.35 6.7,70.35 80.45,72.85 106.7,52.85 102.95,49.1 102.95,46.6 21.7,29.1 55.45,25.35 59.2,25.35 59.2,16.6 55.45,16.6 70.45,14.1 82.95,15.35 91.7,14.1 47.95,12.85 36.7,12.85 84.2,42.85 67.95,52.85 61.7,52.85 54.2,52.85 41.7,52.85 42.95,37.85 72.95,60.35 95.45,67.85 87.95,60.35 52.95,59.1 22.95,64.1 26.7,37.85 95.45,30.35 45.45,69.1 59.2,30.35 81.15,20.3 102.95,29.1 100.45,29.1 92.95,22 94.9,26.15 92,25.95 7.95,57.85 11.7,56.6 12.95,35.35 45.95,58.65 36.7,70.35 36.7,67.85
  pour Route2 (isolate 0.254): -0.05,79.1 110.95,79.1 110.95,0.1 -0.05,0.1
  pour Top (isolate 0.254): -0.05,79.6 -0.05,0.1 110.95,0.1 110.95,79.6
N$1
  Top 0.25: Q2.3 106.22,31.52 Q7.2
N$2  (via drill 0.35)
  Top 0.25: v90.45,35.1 89.45,36.1 R66.2
  Bottom 0.25: Q7.1 105.1,35.1 v90.45,35.1
N$3
  Top 0.25: IC3.10 11.7,65.35 11.95,65.6 12.45,65.6 14.45,63.6 C25.2
N$4
  Top 0.25: R6.1 81.95,66.6 83.04,67.7 86.18,67.7 87.95,69.47 91.02,69.47 94.25,72.7 98.59,72.7 D1.A
N$5
  Top 0.25: IC4.2 12.24,31.52 12.94,31.52 13.35,31.93 13.35,32.5 13.95,33.1 R12.1 15.45,33.95 15.45,37.1 16.3,37.95 R11.2
N$6
  Top 0.25: IC4.1 14.4,30.4 C18.1
N$7  (via drill 0.35)
  Top 0.25: U1.11 42.25,63.3 v42.45,63.1 | v46.45,53.1 46.52,53.1 47.17,52.44 48.29,52.44 50.22,54.37 U2.5
  Bottom 0.25: v42.45,63.1 42.52,63.1 43.17,62.44 44.03,62.44 46.95,59.53 46.95,53.6 v46.45,53.1
N$8  (via drill 0.35)
  Top 0.25: U1.12 43.05,64 v43.95,63.1 | v47.45,53.1 47.45,53.3 47.7,53.55 47.7,55.37 U2.3
  Bottom 0.25: v43.95,63.1 47.45,59.6 v47.45,53.1
N$9
  Top 0.25: U2.10 50.22,61.33 49.69,61.85 42.69,61.85 41.45,63.1 U1.10
N$10
  Top 0.25: R7.1 86.02,68.1 87.79,69.87 90.85,69.87 94.08,73.1 96.5,73.1 D2.A
N$11
  Top 0.25: IC4.3 12.85,32 12.95,32.1 12.95,34.1 14.45,35.6 R10.2
N$12
  Top 0.25: IC3.7 11.7,58.92 12.02,58.6 12.45,58.6 14.45,60.6 C25.1
N$13
  Top 0.25: IC3.6 11.2,58.85 12.95,57.1 C26.2
N$14
  Top 0.25: R4.1 R53.2 9.2,68 IC3.15
N$15
  Top 0.25: R51.1 R52.2 60.3,69.2 IC1.8
N$16
  Top 0.25: R54.1 R55.2 11.12,54.08 11.12,55.21 10.29,56.03 10.29,58.35 10.2,58.45 IC3.4
N$17
  Top 0.25: R8.1 86.95,69.6 87.62,70.27 90.69,70.27 94.47,74.05 D3.A
N$20
  Top 0.25: IC2.8 91.74,42.45 R5.1 R13.2
N$22
  Top 0.25: C30.1 8.41,64.6 IC3.16
N$23
  Top 0.25: IC3.3 9.7,58.35 8.45,57.1 C29.1
N$24  (via drill 0.35)
  Top 0.25: R46.2 v60.95,48.1
  Bottom 0.25: v60.95,48.1 60.56,48.1 43.45,30.98 43.45,29.03 35.45,21.03 35.45,19.6 37.68,17.37 K1.4
N$26
  Top 0.25: U1.5 36.7,68.7 R1.1 36.27,66.62 36.27,64.77 36.8,64.25 C2.1
N$27
  Top 0.25: U1.31 41.45,75.95 R3.1
N$29
  Top 0.25: Q4.1 103.87,5.71 Q3.4 99.3,7.6 C32.1 97.17,8.78 94.63,8.78 94.5,8.65 C31.1 92.05,8.25 R61.2
N$30  (via drill 0.35)
  Top 0.25: v58.95,48.1 58.95,47.45 R47.1
  Bottom 0.25: K1.9 33.91,18.35 35.01,19.45 35.01,21.16 43.03,29.18 43.03,31.13 58.95,47.05 v58.95,48.1
N$31
  Top 0.25: R22.1 20.93,54.5 22.03,55.6 22.03,56.51 22.2,56.68 24.87,56.68 25.18,56.37 U4.3 25.2,55.62 R26.2
N$32
  Top 0.25: D10.A 79.35,2.7 78.45,3.6 78.47,3.62 78.47,7.31 79.41,8.25 K4.12 80.92,9.75 81.32,10.15 83.33,10.15 84.03,10.85 90.96,10.85 91.58,11.48 93.31,11.48 93.47,11.31 93.47,11.07 95.37,9.18 98.82,9.18 99.13,8.87 100.75,8.87 Q4.3
N$33
  Top 0.25: U4.2 23.95,55.6 23.95,52.6 22.7,51.35 R14.1 20.5,50.7 R18.2
N$34  (via drill 0.35)
  Top 0.25: R48.2 54.95,41.56 v55.47,42.08
  Bottom 0.25: v55.47,42.08 55.11,42.08 51.45,38.42 51.45,25.1 49.38,23.04 49.38,18.47 K2.4
N$35
  Top 0.25: Q5.3 102.02,10.1 Q4.2
N$36  (via drill 0.35)
  Top 0.25: v50.79,27.6 51.44,28.25 60.11,28.25 63.47,31.6 64.69,31.6 65.38,32.29 65.38,39.02 R49.2
  Bottom 0.25: K2.9 48.98,20.94 48.98,23.2 50.91,25.13 50.91,27.48 v50.79,27.6
N$38
  Top 0.25: R50.2 62.5,40.45 63.28,41.23 64.61,41.23 65.78,40.06 65.78,22.27 67.03,21.01 68.36,21.01 72.01,17.37 K3.4
N$39
  Top 0.25: R35.1 32.05,62.2 30.86,61.01 30.86,60.18 30.7,60.02 28.02,60.02 27.72,60.33 U4.10 27.7,61.08 R31.2
N$40
  Top 0.25: U6.5 94.85,21 95.25,20.6 C35.1 96.1,19.75 97.34,18.5 98.85,18.5 100.37,20.02 100.37,24.71 101.1,25.45 101.1,29.69 102.95,31.53 102.95,40.1 103.3,40.45 R64.1
N$41
  Top 0.25: Q6.3 79.25,26.1 83.38,21.97 83.38,21.01 K4.5
N$42
  Top 0.25: R9.1 90.95,71.1 92.45,72.6 D4.A
N$43
  Top 0.25: U4.9 28.95,61.1 28.95,64.1 30.2,65.35 R43.1 32.4,66 R39.2
N$44
  Top 0.25: R30.2 25.2,61.08 U4.12 25.18,60.33 24.87,60.02 22.2,60.02 22.03,60.18 22.03,61.01 20.85,62.2 R34.1
N$45
  Top 0.25: U4.13 23.95,61.1 23.95,64.75 R42.1 20.5,66 R38.2
N$46
  Top 0.25: R27.2 27.7,55.6 27.7,55.62 | 27.7,55.62 U4.5 | R23.1 31.96,54.5 30.86,55.6 30.86,56.51 30.7,56.68 28.02,56.68 27.7,56.35 27.7,55.62
N$47
  Top 0.25: U4.6 28.95,55.6 28.95,52.6 30.2,51.35 R15.1 32.4,50.7 R19.2
N$48
  Top 0.25: R28.2 90.93,57.35 U5.3 90.18,57.33 89.87,57.02 89.87,52.83 R24.1
N$49
  Top 0.25: U5.2 94.64,56.06 R16.1 95.85,52.65 R20.2
N$50
  Top 0.25: R33.2 85.46,59.85 U5.10 86.22,59.87 86.52,60.18 86.52,64.37 R37.1
N$51
  Top 0.25: U5.9 85.44,61.1 81.3,61.1 R45.1 79.35,63.35 R41.2
N$52
  Top 0.25: R32.2 85.46,57.35 U5.12 86.22,57.33 86.52,57.02 86.52,52.83 R36.1
N$53
  Top 0.25: U5.13 81.76,56.06 R44.1 80.55,52.65 R40.2
N$54
  Top 0.25: R29.2 90.93,59.85 U5.5 90.18,59.87 89.87,60.18 89.87,64.37 R25.1
N$55
  Top 0.25: U5.6 94.64,61.14 R17.1 95.85,64.55 R21.2
N$56
  Top 0.25: R56.2 91.87,1.83 Q3.2
N$61
  Top 0.25: R68.1 U6.31
NRST_TCU  (via drill 0.35)
  Top 0.25: U1.4 35.7,69.5 35.62,69.42 | 35.62,69.42 R2.1 | 68.02,75.02 C4.1 67.95,74.8 S3.3 | 68.02,75.02 69.1,76.1 S3.4 | v50.95,73.6 51.49,74.14 SWD1.3 51.49,74.28 52.77,73.01 55.35,73.01 57.45,75.1 67.95,75.1 68.02,75.02 | v33.95,70.1 34.62,69.42 35.62,69.42 | J1.3 25.57,43.22 v25.95,43.6
  Route15 0.25: v25.95,43.6 27.91,45.57 27.91,49.07 28.45,49.6 28.45,56.24 32.95,60.74 32.95,69.1 v33.95,70.1
  Bottom 0.25: v50.95,73.6 50.95,73.1 48.85,71 41.97,71 41.72,71.25 35.1,71.25 v33.95,70.1
NRST_UCU  (via drill 0.35)
  Top 0.25: R69.1 94.05,20.85 U6.4 93.78,24.25 93.78,26.69 91.95,28.53 v91.95,28.6 | SWD2.3 48.73,3.23 49.57,4.08 51.93,4.08 51.95,4.1 52.45,4.1 52.95,3.6 54.95,3.6 60.07,8.72 J3.3 59.95,10.24 59.95,10.6 61.95,12.6 v62.45,12.6 | R69.1 94.65,20.6 97.15,18.1 99.02,18.1 101.02,20.1 S1.3 S1.4 | R69.1 C36.1
  Route2 0.25: v91.95,28.6 91.39,29.16 91.39,30.52 90.46,31.44 88.06,31.44 86.81,32.69 67.31,32.69 64.06,29.43 64.06,14.93 62.45,13.32 v62.45,12.6
R_TCU
  Top 0.25: U1.21 47.66,69.6 48.45,69.6 48.74,69.9 53.93,69.9 55.74,68.09 55.74,67.09 55.91,66.93 57.77,66.93 58.05,66.65 58.05,64.2 57.54,63.69 IC1.4
R_UCU
  Top 0.25: U6.21 94.05,33.7 95.85,35.5 IC2.4
RPS1_GND  (via drill 0.35)
  Top 0.25: FRONT_CONNECTOR.38 FRONT_CONNECTOR.49 | R30.1 25.2,66.85 v24.95,67.1 | R45.2 76.64,63.35 v75.95,64.04 | v59.45,45.6 63.5,45.6 C12.1 64.45,46.55 v64.45,50.6
  Route2 0.25: v24.95,67.1 27.04,65 27.04,60.43 41.82,45.65 48.47,45.65 48.67,45.44 49.5,45.44 49.65,45.6 58.94,45.6 58.95,45.6 v59.45,45.6 | v75.95,64.04 76.87,64.04 83.45,57.46 83.45,55.53 81.79,53.87 81.79,48.98 FRONT_CONNECTOR.49
  Bottom 0.25: FRONT_CONNECTOR.38 76.74,43.6 75.32,43.6 74.32,44.6 74.32,44.89 73.61,45.6 72.61,45.6 71.13,45.6 70.23,46.5 68.11,46.5 64.45,50.17 v64.45,50.6
RPS1_IN  (via drill 0.35)
  Top 0.25: R37.2 84.35,66 v84.45,66.1
  Route15 0.25: v84.45,66.1 84.45,60.6 75.45,51.6 75.45,46.73 FRONT_CONNECTOR.37
  Bottom 0.25: K1.3 35.47,14.83 34.36,13.73 33.45,13.73 32.8,14.37 32.8,20.37 33.45,21.01 34.29,21.01 42.62,29.35 42.62,31.3 44.53,33.2 44.53,37.05 57.57,50.1 63.95,50.1 67.95,46.1 70.06,46.1 71.76,44.39 FRONT_CONNECTOR.37
RPS1_OUT
  Top 0.25: R46.1 61.35,45.15 62.95,45.15 C12.2 64.97,45.18 64.97,47.63 68.04,50.7 84.49,50.7 FRONT_CONNECTOR.50
RPS1_SIG_OUT  (via drill 0.35)
  Top 0.25: R38.1 21.02,63.17 21.02,62.6 22.56,61.06 U4.14 22.64,62.79 v22.95,63.1
  Route15 0.25: v30.41,53.1 30.15,52.85 30.15,24.23 33.29,21.1 37.8,21.1 K1.5
  Bottom 0.25: v22.95,63.1 29.04,57 29.04,54.13 29.73,53.44 30.06,53.44 v30.41,53.1
RPS1_VCC
  Top 0.25: FRONT_CONNECTOR.48 FRONT_CONNECTOR.47
RPS2_GND  (via drill 0.35)
  Top 0.25: FRONT_CONNECTOR.30 86.32,40.02 82,40.02 FRONT_CONNECTOR.29 | R31.1 27.7,66.85 v27.45,67.1 | v48.95,46.1 54.9,46.1 C13.1 57.45,48.55 v57.45,48.94
  Route2 0.25: v27.45,67.1 27.45,60.6 41.95,46.1 v48.95,46.1
  Bottom 0.25: v57.45,48.94 58.15,49.65 63.83,49.65 67.78,45.7 69.85,45.7 72.45,43.1 78.83,43.1 FRONT_CONNECTOR.29
RPS2_IN
  Bottom 0.25: FRONT_CONNECTOR.27 71.91,41.18 54.78,41.18 51.85,38.25 51.85,17.17 50.94,16.27 50.03,16.27 50,16.23 35.31,16.23 K1.10
RPS2_OUT
  Top 0.25: C13.2 57.35,44.15 R47.2 59.5,44.75 60.28,43.97 61.57,43.97 62.32,43.22 68.16,43.22 68.19,43.19 79.04,43.19 81.45,45.6 85.17,45.6 FRONT_CONNECTOR.40
RPS2_SIG_OUT  (via drill 0.35)
  Top 0.25: U4.8 30.33,61.06 31.87,62.6 31.87,63.17 R39.1 32.05,64 v31.45,64.6
  Route15 0.25: v30,54.1 29.75,53.85 29.75,24.06 K1.8
  Bottom 0.25: v31.45,64.6 31.1,64.25 30.17,64.25 29.45,63.53 29.45,54.66 v30,54.1
RPS2_VCC
  Top 0.25: FRONT_CONNECTOR.39 FRONT_CONNECTOR.28
RPS_STM_ANOUT  (via drill 0.35)
  Top 0.25: R34.2 21.55,59.15 31.35,59.15 R35.2 33.31,59.88 v34.16,59.88 | v50.45,58.6 51.49,59.64 U2.9 U2.8
  Route15 0.25: v34.16,59.88 34.45,60.17 34.45,60.53 38.61,64.7 44.35,64.7 v50.45,58.6
RPS_STM_IN  (via drill 0.35)
  Top 0.25: U5.8 84.99,62.41 R41.1 82.95,65.25 v82.95,66.1 | U1.6 41.25,67.9 v41.45,68.1
  Route2 0.25: v41.45,68.1 58.45,68.1 60.14,66.41 82.64,66.41 v82.95,66.1
RS_TCU  (via drill 0.35)
  Top 0.25: U1.3 41.15,70.3 v41.45,70.6 | v57.45,74.1 R51.2
  Bottom 0.25: v41.45,70.6 53.95,70.6 v57.45,74.1
RS_UCU  (via drill 0.35)
  Top 0.25: R5.2 88.45,39.75 v88.45,39.6 | v92.95,26.6 93.25,26.3 U6.3
  Route15 0.25: v92.95,26.6 88.45,31.1 v88.45,39.6
RX_TCU  (via drill 0.35)
  Top 0.25: J1.7 23.07,42.72 v23.95,43.6 | v46.29,74.6 46.29,73.26 U1.25
  Route15 0.25: v23.95,43.6 24.6,44.25 26.03,44.25 27.51,45.73 27.51,49.23 28.04,49.77 28.04,56.4 32.54,60.9 32.54,69.7 37.45,74.6 v46.29,74.6
RX_UCU  (via drill 0.35)
  Top 0.25: J3.7 57.57,11.22 v59.45,13.1 | v92.45,30.6 92.1,30.95 90.38,30.95 U6.25
  Route2 0.25: v59.45,13.1 59.95,13.1 62.45,15.6 62.45,30.1 66.65,34.3 88.75,34.3 v92.45,30.6
SPEED_SENS_12V
  Top 0.25: FRONT_CONNECTOR.8 FRONT_CONNECTOR.18 79.68,37.7 89.2,37.7 R66.1
SPEED_SENS_GND  (via drill 0.35)
  Top 0.25: FRONT_CONNECTOR.19 FRONT_CONNECTOR.9 | R67.1 108.87,29.67 Q2.2 106.26,29.67 105.71,29.12 104.88,29.12 104.04,29.96 104.04,32.85 v103.79,33.1
  Bottom 0.25: v103.79,33.1 102.6,34.29 91.21,34.29 90.96,34.04 83.47,34.04 FRONT_CONNECTOR.19
SPEED_SENS_IN
  Top 0.25: U6.15 100.95,30.1 102.52,31.67 102.52,41.76 103.3,42.54 R65.1 103.38,44.18 Q7.4
SPEED_SENS_SIG  (via drill 0.35)
  Top 0.25: FRONT_CONNECTOR.20 FRONT_CONNECTOR.10 | R67.2 107.72,30.23 106.18,30.23 105.63,29.67 Q2.1 104.45,30.52 104.45,34.1 104.1,34.44 v103.95,34.44
  Bottom 0.25: v103.95,34.44 103.1,34.44 102.85,34.7 91.04,34.7 90.79,34.44 87.49,34.44 FRONT_CONNECTOR.20
STM_12_INDIC  (via drill 0.35)
  Top 0.25: R70.1 56.95,59.1 | 56.95,59.1 R71.2 60.1,60.1 65.55,60.1 v65.95,59.7 | U1.14 44.65,63.1 45.49,62.25 53.79,62.25 56.95,59.1 | U6.14 96.15,29.3 v95.95,29.1
  Route2 0.25: v95.95,29.1 94.45,27.6 93.87,27.6 93.72,27.44 91.53,27.44 90.45,28.53 90.45,30.32 90.17,30.6 88.12,30.6 87.04,29.52 65.29,29.52 64.86,29.1 64.86,20.41 K3.9
  Route15 0.25: v65.95,59.7 65.95,19.33 K3.9
SWDCLK_TCU  (via drill 0.35)
  Top 0.25: SWD1.4 51.45,76.27 51.45,76.6 50.88,77.16 48.11,77.16 46.95,75.99 46.95,72.51 47.4,72.06 | 47.4,72.06 U1.24 | J1.4 25.57,34.97 23.88,36.67 23.88,37.85 v24.13,38.1 | v47.92,73.1 47.92,72.57 47.4,72.06
  Route15 0.25: v24.13,38.1 23.29,38.94 22.78,38.94 22.39,39.33 22.39,39.69 21.39,40.69 21.39,44.04 22.85,45.5 25.57,45.5 26.3,46.23 26.3,49.73 26.84,50.27 26.84,56.9 29.62,59.69 29.62,62.93 29.39,63.16 29.39,64.04 31.74,66.39 31.74,70.03 37.11,75.4 43.82,75.4 44.67,76.25 45.79,76.25 47.92,74.13 v47.92,73.1
SWDCLK_UCU  (via drill 0.35)
  Top 0.25: SWD2.4 48.73,1.96 49.57,1.12 52.04,1.12 53.71,2.79 55.28,2.79 58.18,5.7 59.35,5.7 60.07,4.97 60.07,4.36 | 60.07,4.36 J3.4 | U6.24 89.56,32.21 v89.45,32.1 | v60.67,4.95 60.07,4.36
  Route2 0.25: v89.45,32.1 88.05,33.49 66.98,33.49 63.25,29.77 63.25,15.27 59.82,11.83 59.82,5.8 v60.67,4.95
SWDIO_TCU  (via drill 0.35)
  Top 0.25: SWD1.2 49.69,76.76 48.28,76.76 47.35,75.83 47.35,74.7 48.58,73.47 | U1.23 48.14,71.1 48.58,71.53 48.58,73.47 | J1.2 26.82,34.72 24.53,37.01 v24.53,37.1 | v48.95,74.27 48.95,73.84 48.58,73.47
  Route15 0.25: v24.53,37.1 24.19,37.44 23.86,37.44 23.45,37.85 23.45,38.21 23.12,38.54 22.61,38.54 21.99,39.16 21.99,39.52 20.99,40.52 20.99,44.21 22.68,45.9 25.41,45.9 25.9,46.4 25.9,49.9 26.43,50.43 26.43,57.07 27.45,58.08 27.45,58.1 28.95,59.6 28.96,59.6 29.22,59.85 29.22,62.76 28.99,62.99 28.99,64.21 31.34,66.56 31.34,70.2 36.95,75.81 43.66,75.81 44.51,76.66 45.96,76.66 48.35,74.27 v48.95,74.27
SWDIO_UCU  (via drill 0.35)
  Top 0.25: SWD2.2 50.06,1.96 50.5,1.52 51.87,1.52 53.54,3.2 55.11,3.2 58.02,6.1 60.45,6.1 61.32,5.22 | 61.32,5.22 J3.2 | U6.23 92.45,33.1 91.95,33.6 88.75,33.6 v87.79,32.64 | v61.45,6.6 61.45,5.35 61.32,5.22
  Route2 0.25: v87.79,32.64 87.34,33.09 67.15,33.09 63.65,29.6 63.65,15.1 60.22,11.67 60.22,7.82 v61.45,6.6
SWO_TCU  (via drill 0.35)
  Top 0.25: U1.26 45.45,75.06 | 45.45,75.06 47.95,77.56 51.98,77.56 52.76,76.79 SWD1.6 | J1.6 24.32,35.22 23.47,36.07 23.47,39.17 v23.05,39.6 | v45.45,75.6 45.45,75.06
  Route15 0.25: v23.05,39.6 21.79,40.86 21.79,43.87 23.02,45.1 25.74,45.1 26.71,46.07 26.71,49.57 27.24,50.1 27.24,56.74 30.02,59.52 30.02,63.09 29.79,63.33 29.79,63.87 32.14,66.22 32.14,69.86 37.28,75 44.85,75 v45.45,75.6
SWO_UCU  (via drill 0.35)
  Top 0.25: SWD2.6 48.38,0.72 52.2,0.72 53.88,2.39 55.45,2.39 57.65,4.6 58.45,4.6 58.82,4.22 58.82,4 | U6.26 91.95,30.1 v92.45,29.6 | v59.42,4.6 58.82,4 | 58.82,4 J3.6
  Route2 0.25: v92.45,29.6 91.79,30.25 91.79,30.69 88.58,33.9 66.81,33.9 62.85,29.93 62.85,15.43 59.42,12 v59.42,4.6
TX_TCU  (via drill 0.35)
  Top 0.25: J1.8 23.07,38.47 22.39,39.15 22.39,43.55 v22.45,43.6 | v36.93,65.08 38.15,66.3 U1.8
  Route15 0.25: v22.45,43.6 23.5,44.66 25.87,44.66 27.11,45.9 27.11,49.4 27.64,49.93 27.64,56.57 30.45,59.37 v30.45,63.6
  Bottom 0.25: v30.45,63.6 35.45,63.6 v36.93,65.08
TX_UCU  (via drill 0.35)
  Top 0.25: v63.45,2.6 61.95,1.1 57.95,1.1 57.45,1.6 57.45,2.6 J3.8 | v93.45,28.1 93.6,27.94 94.53,27.94 97.25,25.23 U6.8
  Route2 0.25: v93.45,28.1 92.37,28.1 92.22,27.94 91.6,27.94 90.95,28.6 90.95,30.39 90.3,31.04 87.99,31.04 86.87,29.93 65.12,29.93 64.46,29.27 64.46,3.61 v63.45,2.6

## Text on the board
tPlace: CCU - TCU/UCU / Rev2, 21.03.25 | R_TCU | 3.3V | 5V | 12V | EXT_MODE | TCU | R_UCU | DB | ->Y+ | +X<- | UCU